# Altium schematic sheet TPS6120x.SchDoc
size A4
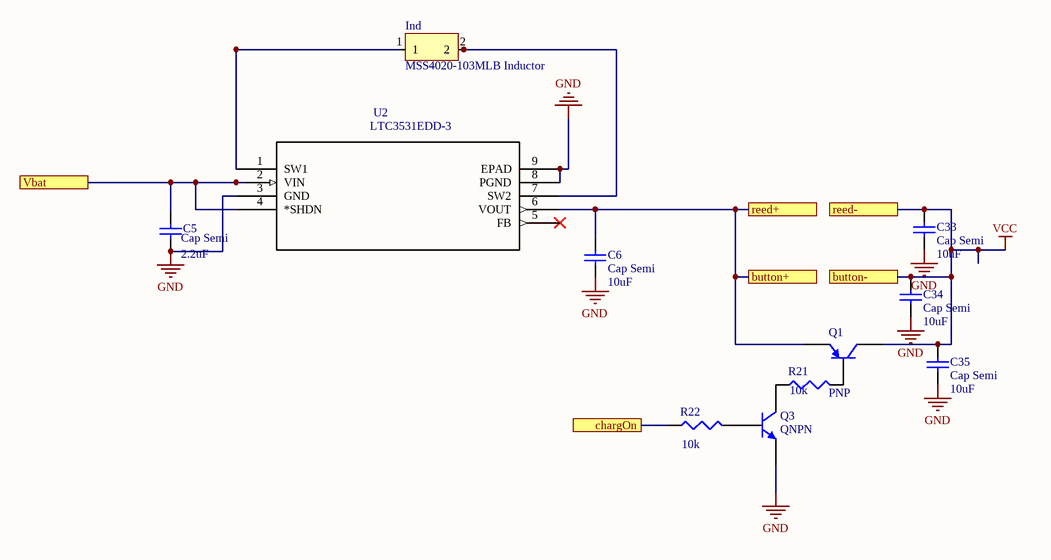
[diagram p0: TPS6120x.SchDoc]

## Parts
C5  Cap Semi  value 2.2uF  [1608[0603]]
C6  Cap Semi  value 10uF  [1608[0603]]
C33  Cap Semi  value 10uF  [1608[0603]]
C34  Cap Semi  value 10uF  [1608[0603]]
C35  Cap Semi  value 10uF  [1608[0603]]
Ind  MSS4020-103MLB Inductor  [MSS4020-103MLB]
Q1  PNP  [SOT-23B_N]
Q3  QNPN  [SOT-23B_N]
R21  value 10k  [J1-0603]  (hidden comment: Res3)
R22  value 10k  [J1-0603]  (hidden comment: Res3)
U2  LTC3531EDD-3  [LTC3531EDD-3]

## Ports
button+, button-, chargOn, reed+, reed-, Vbat

## Nets
GND: C5.1 C6.1 C33.1 C34.1 C35.1 Q3.3(E) U2.3(GND) U2.8(PGND) U2.9(EPAD)
VCC: C33.2 C34.2 C35.2 Q1.1(C) ; port button-, port reed-
button+: C6.2 Q1.3(E) U2.6(VOUT) ; port button+, port reed+
chargOn: R22.1 ; port chargOn
Vbat: C5.2 U2.2(VIN) U2.4(*SHDN) ; port Vbat
NetInd_1: Ind.1 U2.1(SW1)
NetInd_2: Ind.2 U2.7(SW2)
NetQ1_2: Q1.2(B) R21.2
NetQ3_1: Q3.1(C) R21.1
NetQ3_2: Q3.2(B) R22.2

Not connected (* = marked no-connect by the designer): U2 5(FB)*

## Library data of the parts
C5 C6 C33-C35 = Cap Semi: Capacitor (Semiconductor SIM Model); Published: 8-Jun-2000; LatestRevisionDate: 29-May-2009; LatestRevisionNote: IPC-7351 Footprint Added.; PackageReference: C1206; Publisher: Altium Limited; PackageDescription: Chip Capacitor
Q1 = PNP: PNP Bipolar Transistor; Published: 8-Jun-2000; LatestRevisionDate: 29-May-2009; LatestRevisionNote: IPC-7351 Footprint Added.; PackageVersion: Aug-1999; PackageReference: SOT-23B; Publisher: Altium Limited; PackageDescription: 3-Pin SOT-23 Package 0.95 mm Pitch, 2.4 mm Lead Span
Q3 = QNPN: NPN Bipolar Transistor; Published: 8-Jun-2000; LatestRevisionDate: 29-May-2009; LatestRevisionNote: IPC-7351 Footprint Added.; PackageVersion: Aug-1999; PackageReference: SOT-23B; Publisher: Altium Limited; PackageDescription: 3-Pin SOT-23 Package 0.95 mm Pitch, 2.4 mm Lead Span
R21 R22 = Res3: Resistor; Published: 8-Jun-2000; LatestRevisionDate: 29-May-2009; LatestRevisionNote: IPC-7351 Footprint Added.; PackageReference: J1-0603; Publisher: Altium Limited; PackageDescription: Chip Resistor
U2 = LTC3531EDD-3: LTC3531 - 200mA Buck-Boost Synchronous DC/DC Converters; MF: Linear Technology; Price: None; SnapEDA_Link: https://www.snapeda.com/parts/LTC3531EDD-3/Linear%20Technology/view-part/?ref=snap; Availability: Unavailable; MP: LTC3531EDD-3; Package: None; Value: *